# EAGLE schematic ReflowController_v1.3 (EAGLE 6.3)
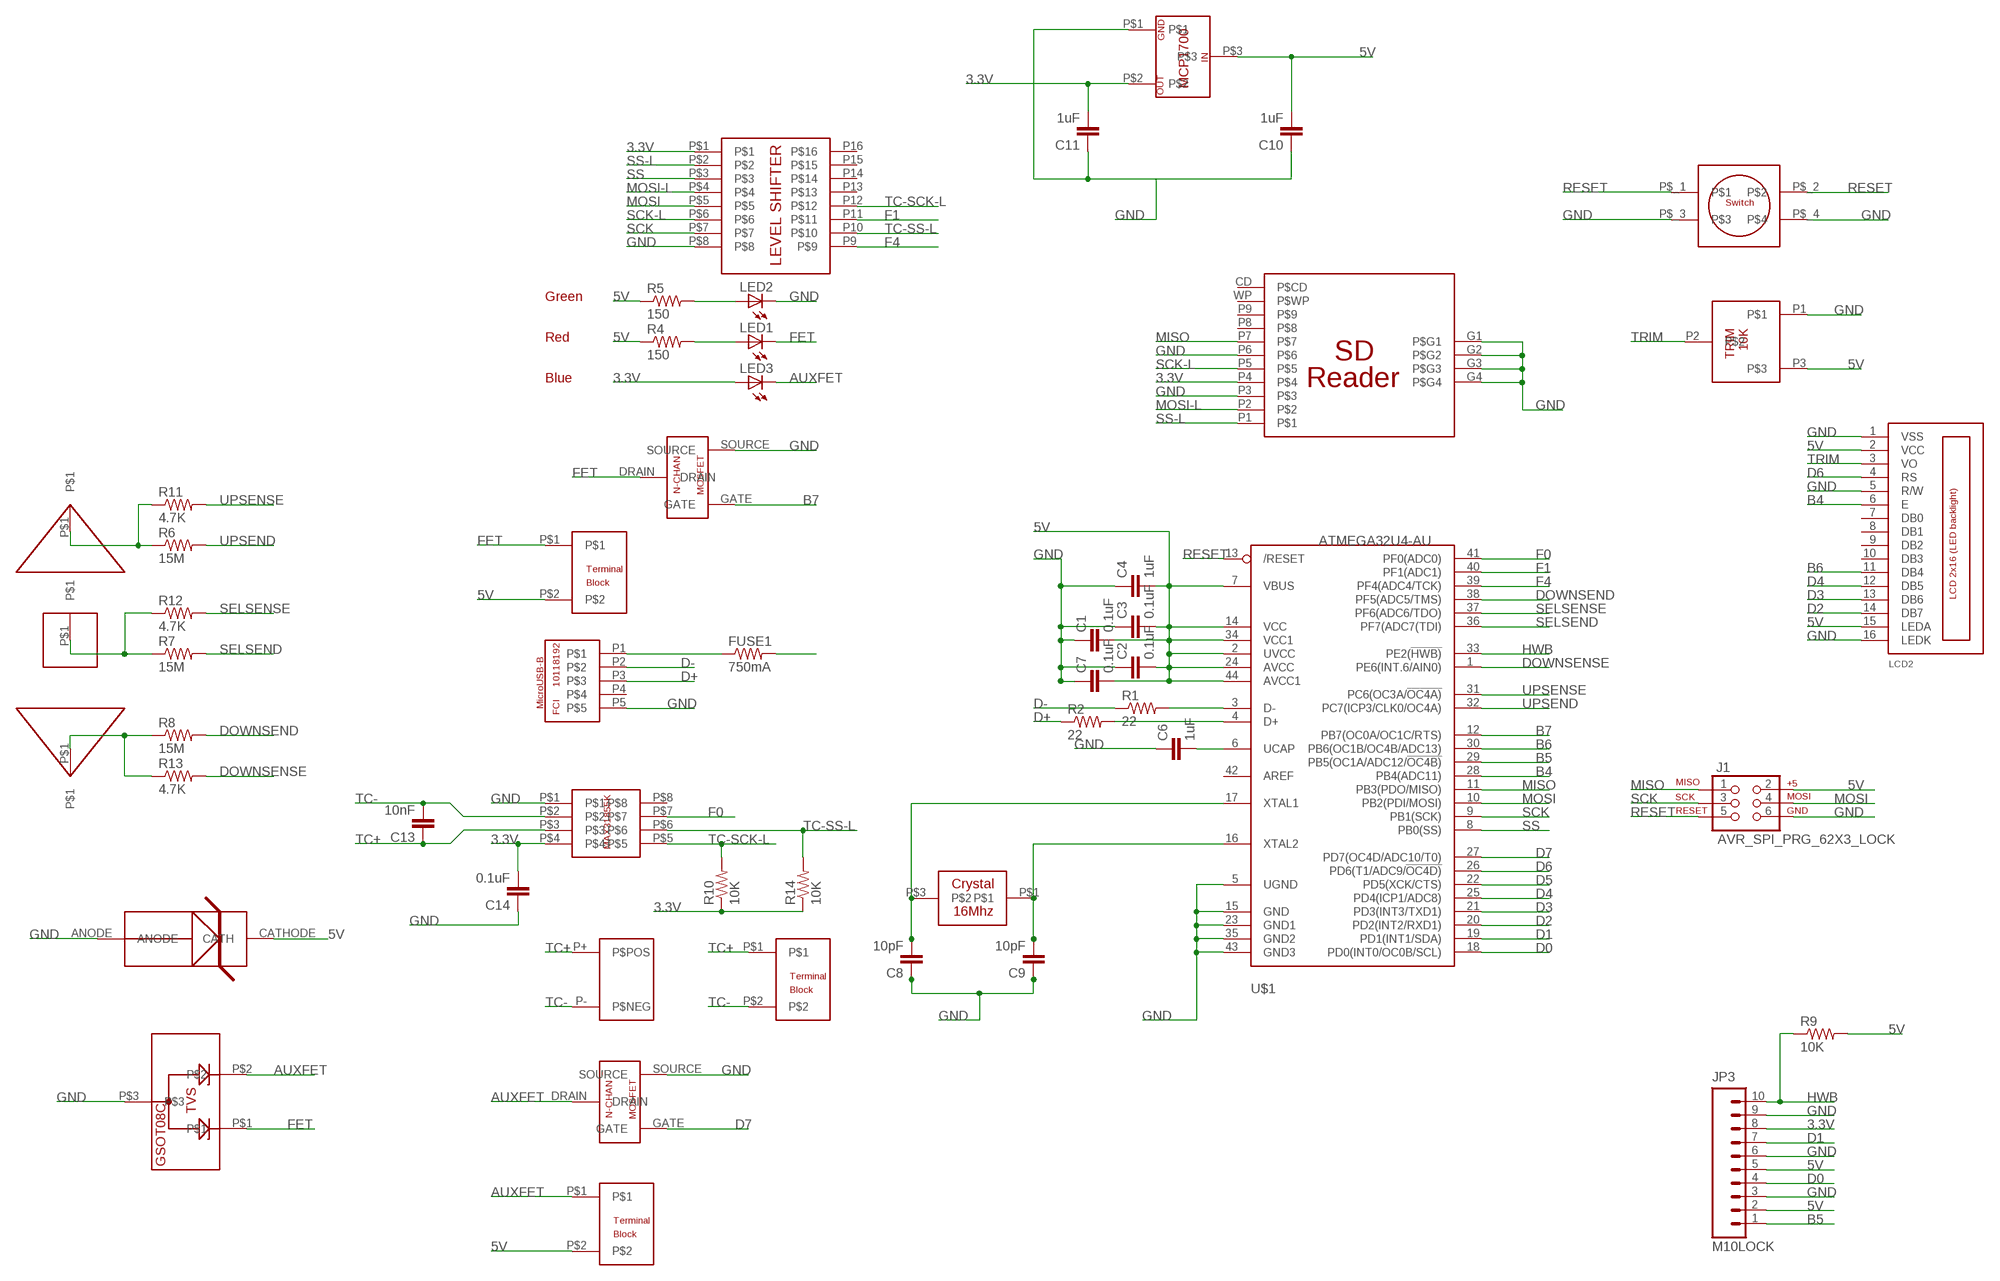
[diagram p0: schematic, sheet 1]

## Parts
C1  0.1uF  CAP0603-CAP  [0603-CAP]
C2  0.1uF  CAP0603-CAP  [0603-CAP]
C3  0.1uF  CAP0603-CAP  [0603-CAP]
C4  1uF  CAP0603-CAP  [0603-CAP]
C6  1uF  CAP0603-CAP  [0603-CAP]
C7  0.1uF  CAP0603-CAP  [0603-CAP]
C8  10pF  CAP0603-CAP  [0603-CAP]
C9  10pF  CAP0603-CAP  [0603-CAP]
C10  1uF  CAP0603-CAP  [0603-CAP]
C11  1uF  CAP0603-CAP  [0603-CAP]
C13  10nF  CAP0603-CAP  [0603-CAP]
C14  0.1uF  CAP0603-CAP  [0603-CAP]
FUSE1  750mA  RESISTOR0603-RES  [0603-RES]
J1  AVR_SPI_PRG_62X3_LOCK  [2X3_LOCK]
JP3  M10LOCK  [1X10_LOCK]
LCD2  LCD_2X16_SIL  [HY-1602F]
LED1  LED0603  [LED-0603]
LED2  LED0603  [LED-0603]
LED3  LED0603  [LED-0603]
R1  22  RESISTOR0603-RES  [0603-RES]
R2  22  RESISTOR0603-RES  [0603-RES]
R4  150  RESISTOR0603-RES  [0603-RES]
R5  150  RESISTOR0603-RES  [0603-RES]
R6  15M  RESISTOR0603-RES  [0603-RES]
R7  15M  RESISTOR0603-RES  [0603-RES]
R8  15M  RESISTOR0603-RES  [0603-RES]
R9  10K  RESISTOR0603-RES  [0603-RES]
R10  10K  RESISTOR0603-RES  [0603-RES]
R11  4.7K  RESISTOR0603-RES  [0603-RES]
R12  4.7K  RESISTOR0603-RES  [0603-RES]
R13  4.7K  RESISTOR0603-RES  [0603-RES]
R14  10K  RESISTOR0603-RES  [0603-RES]
U$1  ATMEGA32U4-AU  [TQFP44]
U$2  16MHZ-CRYSTAL_NX3225GA-16.000M-STD-CRG-1  [16MHZ-CRYSTAL_NX3225GA-16.000M-STD-CRG-1]
U$3  USB-B_10118192-0001LF  [USB-B_10118192-0001LF]
U$4  SDREADER_2041021-4  [SDREADER_2041021-4]
U$5  2POS_TERM_ED2748-ND  [2POS_TERM_ED2748-ND]
U$6  N-MOSFET630_DMG1012T-7DICT-ND  [N-MOSFET630_DMG1012T-7DICT-ND]
U$7  2POS_TERM_ED2748-ND  [2POS_TERM_ED2748-ND]
U$8  NXP_LVL_SHIFT_74HC4050D,653  [NXP_LVL_SHIFT_74HC4050D,653]
U$9  MAX_TC_MAX31855KASA+  [MAX_TC_MAX31855KASA+]
U$10  10K_TRIM_3362F-1-103LF  [10K_TRIM_3362F-1-103LF]
U$11  MCP1700__LDO  [MCP1700__LDO]
U$12  MOM-SWITCH-EG4620CT-ND  [MOM-SWITCH-EG4620CT-ND]
U$13  CAPTOUCH_ARROW  [CAPTOUCH_ARROW]
U$14  CAPTOUCH_ARROW  [CAPTOUCH_ARROW]
U$15  CAPTOUCH_SQUARE  [CAPTOUCH_SQUARE]
U$16  N-MOSFET630_DMG1012T-7DICT-ND  [N-MOSFET630_DMG1012T-7DICT-ND]
U$17  2POS_TERM_ED2748-ND  [2POS_TERM_ED2748-ND]
U$18  TVS_DIODE_MATRIX_GSOT08C-GS08  [TVS_DIODE_MATRIX_GSOT08C-GS08]
U$19  TVS_DIODE_1CH_1SMB6.0AT3G  [TVS_DIODE_1CH_1SMB6.0AT3G]
U$20  CUSTOM_K-TYPE  [CUSTOM_K-TYPE]

## Nets
3.3V: C11.2 C14.2 JP3.8 LED3.A R10.1 R14.1 U$4.P4 U$8.P$1 U$9.P$4 U$11.P$2
5V: C1.2 C2.2 C3.2 C4.2 C7.2 C10.2 FUSE1.2 J1.2 JP3.2 JP3.5 LCD2.2(VCC) LCD2.15(LEDA) R4.1 R5.1 R9.2 U$1.2(UVCC) U$1.7(VBUS) U$1.14(VCC) U$1.24(AVCC) U$1.34(VCC1) U$1.44(AVCC1) U$5.P$2 U$10.P3 U$11.P$3 U$17.P$2 U$19.CATHODE(CATH)
AUXFET: LED3.C U$16.DRAIN U$17.P$1 U$18.P$2
B4: LCD2.6(E) U$1.28(PB4(ADC11))
B5: JP3.1 U$1.29(PB5(OC1A/ADC12/!OC4B))
B6: LCD2.11(DB4) U$1.30(PB6(OC1B/OC4B/ADC13))
B7: U$1.12(PB7(OC0A/OC1C/RTS)) U$6.GATE
D0: JP3.4 U$1.18(PD0(INT0/OC0B/SCL))
D1: JP3.7 U$1.19(PD1(INT1/SDA))
D2: LCD2.14(DB7) U$1.20(PD2(INT2/RXD1))
D3: LCD2.13(DB6) U$1.21(PD3(INT3/TXD1))
D4: LCD2.12(DB5) U$1.25(PD4(ICP1/ADC8))
D5: U$1.22(PD5(XCK/CTS))
D6: LCD2.4(RS) U$1.26(PD6(T1/ADC9/!OC4D))
D7: U$1.27(PD7(OC4D/ADC10/T0)) U$16.GATE
D+: R2.1 U$3.P3
D-: R1.1 U$3.P2
DOWNSEND: R8.2 U$1.38(PF5(ADC5/TMS))
DOWNSENSE: R13.2 U$1.1(PE6(INT.6/AIN0))
F0: U$1.41(PF0(ADC0)) U$9.P$7
F1: U$1.40(PF1(ADC1)) U$8.P11
F4: U$1.39(PF4(ADC4/TCK)) U$8.P9
FET: LED1.C U$5.P$1 U$6.DRAIN U$18.P$1
GND: C1.1 C2.1 C3.1 C4.1 C6.1 C7.1 C8.1 C9.1 C10.1 C11.1 C14.1 J1.6 JP3.3 JP3.6 JP3.9 LCD2.1(VSS) LCD2.5(R/W) LCD2.16(LEDK) LED2.C U$1.5(UGND) U$1.15(GND) U$1.23(GND1) U$1.35(GND2) U$1.43(GND3) U$3.P5 U$4.G1(P$G1) U$4.G2(P$G2) U$4.G3(P$G3) U$4.G4(P$G4) U$4.P3 U$4.P6 U$6.SOURCE U$8.P$8 U$9.P$1 U$10.P1 U$11.P$1 U$12.P$_3 U$12.P$_4 U$16.SOURCE U$18.P$3 U$19.ANODE
HWB: JP3.10 R9.1 U$1.33(PE2(!HWB))
MISO: J1.1 U$1.11(PB3(PDO/MISO)) U$4.P7
MOSI: J1.4 U$1.10(PB2(PDI/MOSI)) U$8.P$5
MOSI-L: U$4.P2 U$8.P$4
N$1: C8.2 U$1.17(XTAL1) U$2.P$3
N$2: C9.2 U$1.16(XTAL2) U$2.P$1
N$3: LED1.A R4.2
N$4: LED2.A R5.2
N$5: FUSE1.1 U$3.P1
N$7: R1.2 U$1.3(D-)
N$8: C6.2 U$1.6(UCAP)
N$9: R2.2 U$1.4(D+)
N$15: R6.1 R11.1 U$13.P$1
N$16: R7.1 R12.1 U$15.P$1
N$17: R8.1 R13.1 U$14.P$1
RESET: J1.5 U$1.13(/RESET) U$12.P$_1 U$12.P$_2
SCK: J1.3 U$1.9(PB1(SCK)) U$8.P$7
SCK-L: U$4.P5 U$8.P$6
SELSEND: R7.2 U$1.36(PF7(ADC7(TDI))
SELSENSE: R12.2 U$1.37(PF6(ADC6/TDO))
SS: U$1.8(PB0(SS)) U$8.P$3
SS-L: U$4.P1 U$8.P$2
TC+: C13.1 U$7.P$1 U$9.P$3 U$20.P+(P$POS)
TC-: C13.2 U$7.P$2 U$9.P$2 U$20.P-(P$NEG)
TC-SCK-L: R10.2 U$8.P12 U$9.P$5
TC-SS-L: R14.2 U$8.P10 U$9.P$6
TRIM: LCD2.3(VO) U$10.P2
UPSEND: R6.2 U$1.32(PC7(ICP3/CLK0/OC4A))
UPSENSE: R11.2 U$1.31(PC6(OC3A/!OC4A))
Unconnected: LCD2.7(DB0) LCD2.8(DB1) LCD2.9(DB2) LCD2.10(DB3) U$1.42(AREF) U$3.P4 U$4.CD(P$CD) U$4.P8 U$4.P9 U$4.WP(P$WP) U$8.P13 U$8.P14 U$8.P15 U$8.P16 U$9.P$8

## Notes on the sheet
- Green
- Red
- Blue

## Library data of the parts
C1-C4 C6-C11 C13 C14 = SparkFun-Capacitors:CAP: Capacitor Standard 0603 ceramic capacitor, and 0.1" leaded capacitor.
FUSE1 R1 R2 R4-R14 = SparkFun-Passives:RESISTOR: Resistor Basic schematic elements and footprints for 0603, 1206, and PTH resistors.
J1 = SparkFun-Connectors:AVR_SPI_PRG_6: AVR ISP 6 Pin This is the reduced ISP connector for AVR programming. Common on Arduino. This footprint will take up less PCB space and can be used with a 10-pin to 6-pin adapter such as SKU: BOB-08508
JP3 = SparkFun-Connectors:M10: Header 10 Standard 10-pin 0.1" header. Use with straight break away headers (SKU : PRT-00116), right angle break away headers (PRT-00553), swiss pins (PRT-00743), machine pins (PRT-00117), and female headers (PRT-00115).
LCD2 = lcd_2x16_led_backlight:LCD_2X16_SIL
LED1-LED3 = SparkFun-LED:LED: LEDs Standard schematic elements and footprints for 5mm, 3mm, 1206, and 0603 sized LEDs. 5mm - Spark Fun Electronics SKU : COM-00529 (and others)
U$1 = adafruit:ATMEGA32U4: http://www.ladyada.net/library/eagle
U$2 = JKCustom:16MHZ-CRYSTAL_NX3225GA-16.000M-STD-CRG-1
U$3 = JKCustom:USB-B_10118192-0001LF
U$4 = JKCustom:SDREADER_2041021-4
U$5 U$7 U$17 = JKCustom:2POS_TERM_ED2748-ND
U$6 U$16 = JKCustom:N-MOSFET630_DMG1012T-7DICT-ND
U$8 = JKCustom:NXP_LVL_SHIFT_74HC4050D,653
U$9 = JKCustom:MAX_TC_MAX31855KASA+
U$10 = JKCustom:10K_TRIM_3362F-1-103LF
U$11 = JKCustom:MCP1700__LDO
U$12 = JKCustom:MOM-SWITCH-EG4620CT-ND
U$13 U$14 = JKCustom:CAPTOUCH_ARROW
U$15 = JKCustom:CAPTOUCH_SQUARE
U$18 = JKCustom:TVS_DIODE_MATRIX_GSOT08C-GS08
U$19 = JKCustom:TVS_DIODE_1CH_1SMB6.0AT3G
U$20 = RefloLeo_Lib:CUSTOM_K-TYPE